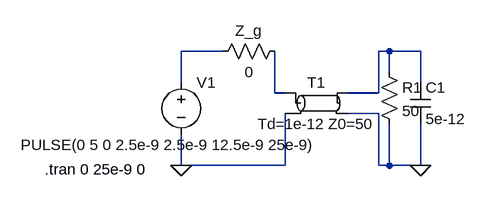
[diagram p0: schematic Conclusion.asc]
Conclusion.asc, the LTspice schematic file:
Version 4
SHEET 1 964 680
WIRE 128 -32 64 -32
WIRE 384 -32 368 -32
WIRE 432 -32 384 -32
WIRE 384 0 384 -32
WIRE 64 16 64 -32
WIRE 432 16 432 -32
WIRE 208 32 208 -32
WIRE 224 32 208 32
WIRE 368 32 368 -32
WIRE 368 32 320 32
WIRE 368 64 320 64
WIRE 64 144 64 96
WIRE 224 144 224 64
WIRE 224 144 64 144
WIRE 368 144 368 64
WIRE 384 144 384 80
WIRE 384 144 368 144
WIRE 432 144 432 80
WIRE 432 144 384 144
FLAG 64 144 0
FLAG 432 144 0
SYMBOL voltage 64 0 R0
WINDOW 3 -247 112 Left 2
WINDOW 123 0 0 Left 0
WINDOW 39 0 0 Left 0
SYMATTR InstName V1
SYMATTR Value PULSE(0 5 0 2.5e-9 2.5e-9 12.5e-9 25e-9)
SYMBOL res 224 -48 R90
WINDOW 0 0 56 VBottom 2
WINDOW 3 32 56 VTop 2
SYMATTR InstName Z_g
SYMATTR Value 0
SYMBOL tline 272 48 R0
SYMATTR InstName T1
SYMATTR Value Td=1e-12 Z0=50
SYMBOL cap 416 16 R0
SYMATTR InstName C1
SYMATTR Value 5e-12
SYMBOL res 368 -16 R0
SYMATTR InstName R1
SYMATTR Value 50
TEXT -146 150 Left 2 !.tran 0 25e-9 0

The netlist it stands for:
* Conclusion.asc
V1 N001 0 PULSE(0 5 0 2.5e-9 2.5e-9 12.5e-9 25e-9)
R§Z_g N003 N001 0
T1 N003 0 N002 0 Td=1e-12 Z0=50
C1 N002 0 5e-12
R1 N002 0 50
.tran 0 25e-9 0
.backanno
.end